# Altium schematic sheet Mosfet_Driver_Circuit.SchDoc
size A4; Organization: ArSilicii s.r.l.; Address1: Via Sardegna, 11; Address2: 53036 Poggibonsi (SI)  - ITALY -; Address3: e-mail : ArSilicii@ArSilicii.com; SheetNumber: 0; SheetTotal: 0
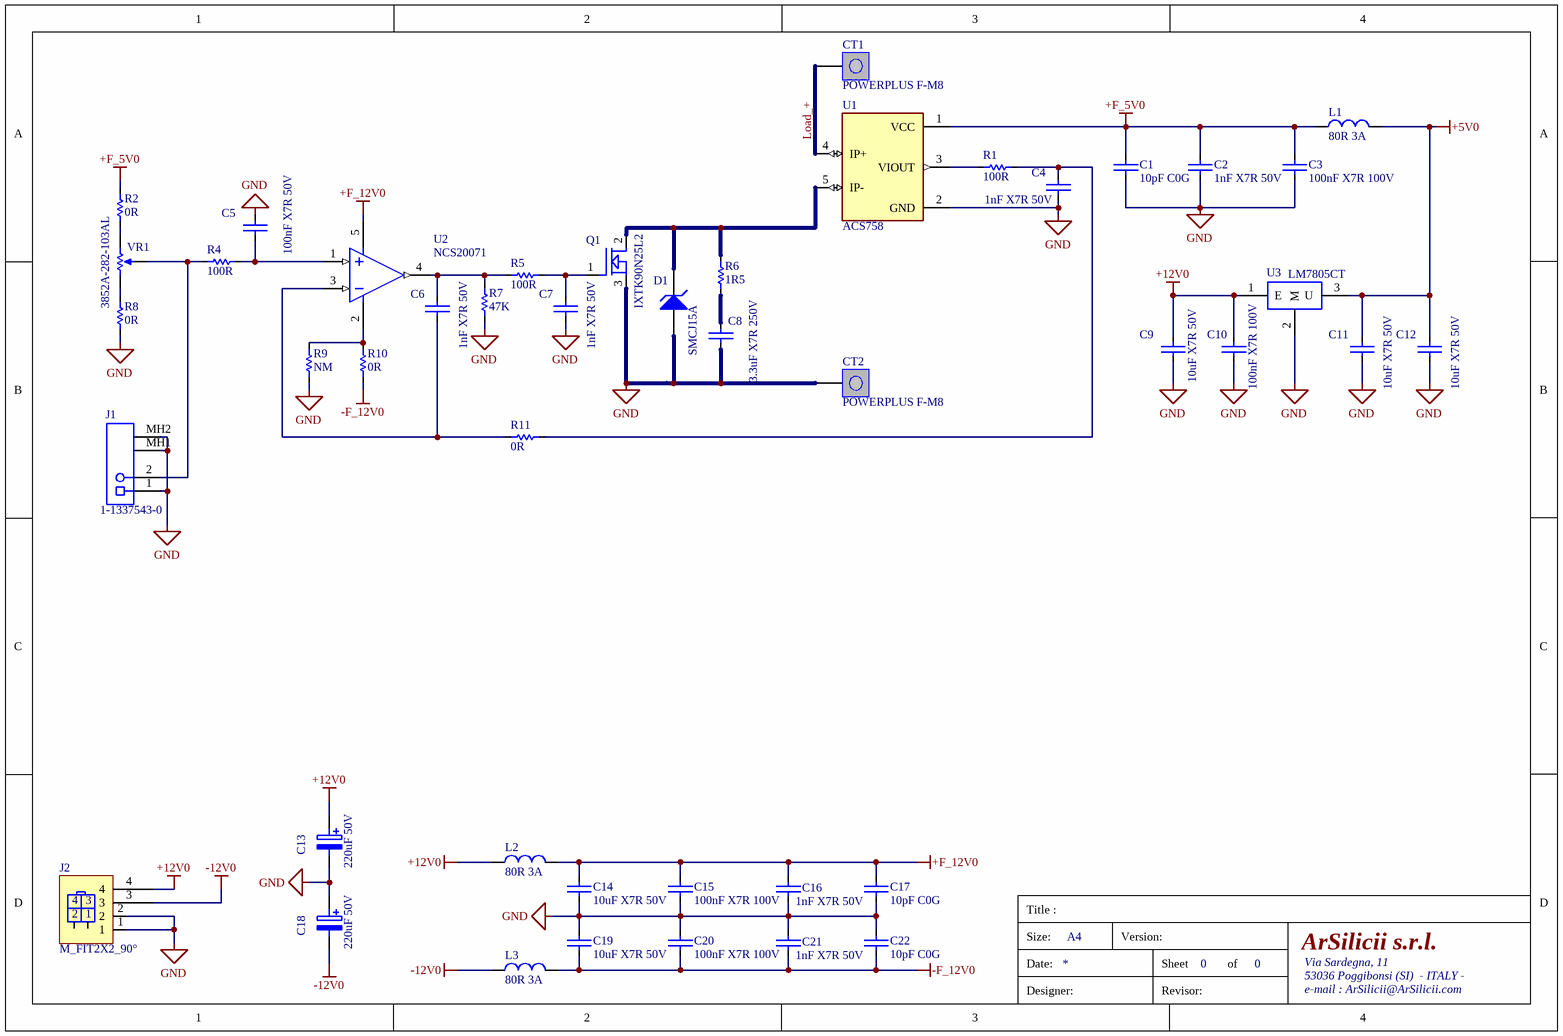
[diagram p0: Mosfet_Driver_Circuit.SchDoc]

## Parts
C1  10pF C0G  [0805]
C2  1nF X7R 50V  [0805]
C3  100nF X7R 100V  [0805]
C4  1nF X7R 50V  [0805]
C5  100nF X7R 50V  [0805]
C6  1nF X7R 50V  [0805]
C7  1nF X7R 50V  [0805]
C8  3.3uF X7R 250V  [2220]
C9  10uF X7R 50V  [1206]
C10  100nF X7R 100V  [0805]
C11  10uF X7R 50V  [1206]
C12  10uF X7R 50V  [1206]
C13  220uF 50V  [C_G55]
C14  10uF X7R 50V  [1206]
C15  100nF X7R 100V  [0805]
C16  1nF X7R 50V  [0805]
C17  10pF C0G  [0805]
C18  220uF 50V  [C_G55]
C19  10uF X7R 50V  [1206]
C20  100nF X7R 100V  [0805]
C21  1nF X7R 50V  [0805]
C22  10pF C0G  [0805]
CT1  POWERPLUS F-M8  [PowerPlus M8]
CT2  POWERPLUS F-M8  [PowerPlus M8]
D1  SMCJ15A  [LFUS-DO-214AB-2_V]
J1  1-1337543-0  [TECO-1-1337543-0_V]
J2  M_FIT2X2_90°  [M_FIT_JR2X2]
L1  80R 3A  [1206]
L2  80R 3A  [1206]
L3  80R 3A  [1206]
Q1  IXTK90N25L2  [TO-247]
R1  100R  [0805]
R2  0R  [0805]
R4  100R  [0805]
R5  100R  [0805]
R6  1R5  [2512]
R7  47K  [0805]
R8  0R  [0805]
R9  NM  [0805]
R10  0R  [0805]
R11  0R  [0805]
U1  ACS758  [XDCR_ACS758]
U2  NCS20071  [SOT-553-5]
U3  LM7805CT  [TO-220]
VR1  3852A-282-103AL  [BOUR-3852A-282-103AL-3_V]

## Nets
+5V0: C11.1 C12.1 L1.1 U3.3(U)
+12V0: C9.1 C10.1 C13.1 J2.4 L2.1 U3.1(E)
+F_5V0: C1.1 C2.1 C3.1 L1.2 R2.2 U1.1(VCC)
+F_12V0: C14.1 C15.1 C16.1 C17.1 L2.2 U2.5
-12V0: C18.2 J2.3 L3.1
-F_12V0: C19.2 C20.2 C21.2 C22.2 L3.2 R10.1
GND: C1.2 C2.2 C3.2 C4.2 C5.1 C7.2 C8.2 C9.2 C10.2 C11.2 C12.2 C13.2 C14.2 C15.2 C16.2 C17.2 C18.1 C19.1 C20.1 C21.1 C22.1 CT2.1 D1.1(A) J1.1 J1.MH1 J1.MH2 J2.1 J2.2 Q1.3(SOURCE) R7.2 R8.1 R9.1 U1.2(GND) U3.2(M)
Load_+: CT1.1 U1.4(IP+)
NetC4_1: C4.1 R1.2 R11.2
NetC5_2: C5.2 R4.2 U2.1
NetC6_1: C6.1 R5.1 R7.1 U2.4
NetC6_2: C6.2 R11.1 U2.3
NetC7_1: C7.1 Q1.1(GATE) R5.2
NetC8_1: C8.1 R6.2
NetD1_2: D1.2(K) Q1.2(DRAIN) R6.1 U1.5(IP-)
NetJ1_2: J1.2 R4.1 VR1.2(S)
NetR1_1: R1.1 U1.3(VIOUT)
NetR2_1: R2.1 VR1.3(CW)
NetR8_2: R8.2 VR1.1(CCW)
NetR9_2: R9.2 R10.2 U2.2

## Notes on the sheet
- Title :
- Size:
- Date:
- A4
- Version:
- Sheet
- of
- Designer:
- Revisor:

## Library data of the parts
C1 C17 C22 = CAP_10pF C0G_0805: Capacità; ArSilicii Part Number: CPC0614010; SMD/TH: SMD; 1 Supplier: *; 1 Supplier Part Number: *; 1 Supplier Unit Price: 0,09; 2 Supplier: *; 2 Supplier Part Number: *; 2 Supplier Unit Price: *; 3 Supplier: *; 3 Supplier Part Number: *; 3 Supplier Unit Price: *; Manufacturer: *; Manufacturer Part Number: *; ComponentLink1URL: *; ComponentLink2URL: *; ComponentLink1Description: *; ComponentLink2Description: *; HelpURL: *
C2 C4 C6 C7 C16 C21 = CAP_1nF X7R 50V_0805: Capacità; ArSilicii Part Number: CPC0213001; Manufacturer: EPCOS / TDK; Manufacturer Part Number: B37941K5102K60; SMD/TH: SMD; 1 Supplier: DISTAR S.R.L.; 1 Supplier Part Number: B37941K5102K60; 1 Supplier Unit Price: 0,00235; 2 Supplier: ARROW ELECTRONICS ITALIA S.R.L.; 2 Supplier Part Number: 0805B102K5CT; 2 Supplier Unit Price: *; 3 Supplier: *; 3 Supplier Part Number: *; 3 Supplier Unit Price: *; ComponentLink1URL: *; ComponentLink2URL: *; ComponentLink1Description: *; ComponentLink2Description: *; HelpURL: *
C3 C10 C15 C20 = CAP_100nF X7R 100V_0805: Capacità; ArSilicii Part Number: CPC0213101; Manufacturer: SAMSUNG; Manufacturer Part Number: CL21B104KCFSFNG; SMD/TH: SMD; 1 Supplier: ARROW ELECTRONICS ITALIA S.R.L.; 1 Supplier Part Number: CL21B104KCFSFNG; 1 Supplier Unit Price: *; 2 Supplier: FARNELL ITALIA S.R.L.; 2 Supplier Part Number: 1907331; 2 Supplier Unit Price: *; 3 Supplier: *; 3 Supplier Part Number: *; 3 Supplier Unit Price: *; ComponentLink1URL: *; ComponentLink2URL: *; ComponentLink1Description: *; ComponentLink2Description: *; HelpURL: *
C5 = CAP_100nF X7R 50V_0805: Capacità; ArSilicii Part Number: CPC0213100; Manufacturer: Kemet; Manufacturer Part Number: C0805C104K5RAC7800; SMD/TH: SMD; 1 Supplier: ARROW ELECTRONICS ITALIA S.R.L.; 1 Supplier Part Number: C0805C104K5RAC7800; 1 Supplier Unit Price: 0,00240; 2 Supplier: AVNET EMG ITALY S.R.L.; 2 Supplier Part Number: 08055C104KAT2A AVX; 2 Supplier Unit Price: *; 3 Supplier: *; 3 Supplier Part Number: *; 3 Supplier Unit Price: *; ComponentLink1URL: *; ComponentLink2URL: *; ComponentLink1Description: *; ComponentLink2Description: *; HelpURL: *
C8 = CAP_1uF X7R 250V_2220: Capacità; Manufacturer: TDK; Manufacturer Part Number: CGA9N3X7R2E105K230KA; SMD/TH: SMD; 1 Supplier: FARNELL ITALIA S.R.L.; 1 Supplier Part Number: 2435506; 1 Supplier Unit Price: 0,606; 2 Supplier: MOUSER; 2 Supplier Part Number: 810-CGA9N3X7R2E105K; 2 Supplier Unit Price: 0,594; 3 Supplier: *; 3 Supplier Part Number: *; 3 Supplier Unit Price: *; ArSilicii Part Number: *; ComponentLink1URL: *; ComponentLink2URL: *; ComponentLink1Description: *; ComponentLink2Description: *; HelpURL: *
C9 C11 C12 C14 C19 = CAP_10uF X7R 50V_1206: Capacità; ArSilicii Part Number: CPC0232011; Manufacturer Part Number: CL31B106KBHNNNE; SMD/TH: SMD; 1 Supplier: ARROW ELECTRONICS ITALIA S.R.L.; 1 Supplier Part Number: CL31B106KBHNNNE; 1 Supplier Unit Price: *; 2 Supplier: *; 2 Supplier Part Number: *; 2 Supplier Unit Price: *; 3 Supplier: *; 3 Supplier Part Number: *; 3 Supplier Unit Price: *; Manufacturer: *; ComponentLink1URL: *; ComponentLink2URL: *; ComponentLink1Description: Datasheet for 10uF X7R 25V; ComponentLink2Description: *; HelpURL: *
C13 C18 = CAP_EL_220uF 50V: Capacità polarizzata; ArSilicii Part Number: CPC0402221; Manufacturer: Nichicon; Manufacturer Part Number: UPS1H221MPD; SMD/TH: TH; 1 Supplier: ARROW ELECTRONICS ITALIA S.R.L.; 1 Supplier Part Number: *; 1 Supplier Unit Price: 0,04516; 2 Supplier: RS COMPONENTS S.P.A.; 2 Supplier Part Number: 5194346; 2 Supplier Unit Price: *; 3 Supplier: *; 3 Supplier Part Number: *; 3 Supplier Unit Price: *; ComponentLink1URL: http://docs-europe.electrocomponents.com/webdocs/0649/0900766b8064973a.pdf; ComponentLink2URL: *; ComponentLink1Description: Datasheet for 220uF 50V; ComponentLink2Description: *; HelpURL: *
CT1 CT2 = PAD_POWERPLUS F-M8: Singolo contatto; ArSilicii Part Number: QC04000180; Manufacturer: WURTH; Manufacturer Part Number: 93517; SMD/TH: TH; 1 Supplier: Würth Elektronik ICS GmbH & Co. KG; 1 Supplier Part Number: S98978; 1 Supplier Unit Price: *; 2 Supplier: *; 2 Supplier Part Number: *; 2 Supplier Unit Price: *; 3 Supplier: *; 3 Supplier Part Number: *; 3 Supplier Unit Price: *; ComponentLink1URL: *; ComponentLink2URL: *; ComponentLink1Description: *; ComponentLink2Description: *; HelpURL: *
D1 = CMP-2000-07102-1: Transient Voltage Suppression Diode, 15 V, -65 to 150 degC, 2-Pin DO-214AB (SMCJ), RoHS, Tape and Reel; Manufacturer: Littelfuse; Directional: Uni-Directional; Power Dissipation: 1500W; Clamping Voltage-Max: 24.4V; Breakdown Voltage-Min: 16.7V; Breakdown Voltage-Max: 18.5V; Mounting Technology: SurfaceMount; Package Reference: DO-214AB; Manufacturer URL: http://www.littelfuse.com/; Package Description: 2-Pin Surface Mount Device, Body 6.855 x 5.905 mm; Datasheet URL: http://www.littelfuse.com/products/tvs-diodes/surface-mount/~/media/electronics/datasheets/tvs_diodes/littelfuse_tvs_diode_smcj_datasheet.pdf.pdf; Datasheet Version: 11/2015
J1 = CMP-2000-05853-1: Female Connector, Pitch 2.54 mm, 1 x 2 Position, Height 15.8 mm, Tail Length 3.8 mm, / -55 to 85 degC, RoHS, Bulk; Manufacturer: TE Connectivity; Connector Body Style: RightAngleJack; Frequency Max: 4GHz; Coaxial Termination: Solder; Connector Mounting: PCBMount; SVHC: ToBeAdvised; Connector Type: BNCCoaxial; Impedance: 50ohm; Coaxial Cable Types: -; Manufacturer URL: http://www.te.com/; Package Reference: 1-1337543-0; Product Range: -; Datasheet URL: http://www.te.com/commerce/DocumentDelivery/DDEController?Action=showdoc&DocId=Customer+Drawing%7F1337543%7FG%7Fpdf%7FEnglish%7FENG_CD_1337543_G.pdf%7F1-1337543-0; Contact Plating: GoldPlatedContacts; Mounting Technology: ThroughHole; Package Description: Female Connector, Pitch 2.54 mm, 1 x 2 Position, Height 15.8 mm, Tail Length 3.8 mm; Contact Material: Brass; Datasheet Version: Rev. G, 12/2012
J2 = M_FIT2X2_90°: Mini Fit Junior 4 poli; ArSilicii Part Number: QA02001000; Manufacturer: Molex; Manufacturer Part Number: 87427-0403; SMD/TH: TH; 1 Supplier: ABACUS ECC S.R.L. - UNIPERSONALE; 1 Supplier Part Number: *; 1 Supplier Unit Price: 0,10556; 2 Supplier: ELECTRO-LINE S.R.L.; 2 Supplier Part Number: *; 2 Supplier Unit Price: *; 3 Supplier: SIRIO S.R.L.; 3 Supplier Part Number: C4255WR-2X2P; 3 Supplier Unit Price: *; ComponentLink1URL: http://datasheet.octopart.com/87427-0403-Molex-datasheet-13790610.pdf; ComponentLink2URL: *; ComponentLink1Description: Datasheet for M_FIT2X2_90°; ComponentLink2Description: *; HelpURL: *
L1-L3 = Ferrite 80R 3A: Ferrite; ArSilicii Part Number: CPF0006000; Manufacturer: Wurth Elektronik; Manufacturer Part Number: 74279215; SMD/TH: SMD; 1 Supplier: RS COMPONENTS S.P.A.; 1 Supplier Part Number: 3275550P; 1 Supplier Unit Price: 0,21000; 2 Supplier: *; 2 Supplier Part Number: *; 2 Supplier Unit Price: *; 3 Supplier: *; 3 Supplier Part Number: *; 3 Supplier Unit Price: *; ComponentLink1URL: http://docs-europe.electrocomponents.com/webdocs/0033/0900766b80033a26.pdf; ComponentLink2URL: *; ComponentLink1Description: Datasheet for Ferrite 80R 3A; ComponentLink2Description: *; HelpURL: *; Supplier 1: Digi-Key; Supplier Part Number 1: 732-1629-1-ND
Q1 = IXTK90N25L2: MOS CANALE N-250V-90A Linear; ArSilicii Part Number: CPTP200080; Manufacturer Part Number: IPB90N06S404ATMA2; SMD/TH: SMD; 1 Supplier: EBV ELEKTRONIK S.R.L.; 1 Supplier Part Number: PB90N06S4-04; 1 Supplier Unit Price: 0,56; 2 Supplier: RS COMPONENTS S.R.L.; 2 Supplier Part Number: 826-9042P; 2 Supplier Unit Price: *; 3 Supplier: *; 3 Supplier Part Number: *; 3 Supplier Unit Price: *; Manufacturer: *; ComponentLink1URL: *; ComponentLink2URL: *; ComponentLink1Description: *; ComponentLink2Description: *; HelpURL: *
R1 R2 R4-R11 = RES_SMD: Resistenza; SMD/TH: SMD; 1 Supplier: *; 1 Supplier Part Number: *; 1 Supplier Unit Price: *; 2 Supplier: *; 2 Supplier Part Number: *; 2 Supplier Unit Price: *; 3 Supplier: *; 3 Supplier Part Number: *; 3 Supplier Unit Price: *; ArSilicii Part Number: *; Manufacturer: *; Manufacturer Part Number: *; ComponentLink1URL: *; ComponentLink2URL: *; ComponentLink1Description: *; ComponentLink2Description: *; HelpURL: *
U1 = ACS758: Current Sensor 50A 1 Channel Hall Effect, Open Loop Unidirectional 5-CB Formed Leads, PFF; MF: Allegro MicroSystems LLC; Package: 5-CB-5 Allegro MicroSystems LLC; MP: ACS758; Availability: *; Price: *; Value: *
U2 = NCS20071: Rail-to-Rail Input/Output, 3 MHz Op Amps; Manufacturer: Microchip Technology; Manufacturer Part Number: MCP6021-E/SN; SMD/TH: SMD; 1 Supplier: DigiKey; 1 Supplier Part Number: MCP6021-E/SN-ND; 1 Supplier Unit Price: 1,22; 2 Supplier: *; 2 Supplier Part Number: *; 2 Supplier Unit Price: *; 3 Supplier: *; 3 Supplier Part Number: *; 3 Supplier Unit Price: *; ArSilicii Part Number: *; ComponentLink1URL: http://ww1.microchip.com/downloads/en/DeviceDoc/21685d.pdf; ComponentLink2URL: *; ComponentLink1Description: Datasheet for MCP6021; ComponentLink2Description: *; HelpURL: *
U3 = LM7805CT: Stabilizzatore 5Volt 7805; ArSilicii Part Number: IC01007010; Manufacturer: Fairchild Semiconductor; SMD/TH: TH; 1 Supplier: ARROW ELECTRONICS ITALIA S.R.L.; 1 Supplier Part Number: *; 1 Supplier Unit Price: 0,085; 2 Supplier: *; 2 Supplier Part Number: *; 2 Supplier Unit Price: *; 3 Supplier: *; 3 Supplier Part Number: *; 3 Supplier Unit Price: *; Manufacturer Part Number: LM7805CT; ComponentLink1URL: http://www.fairchildsemi.com/ds/LM/LM7805.pdf; ComponentLink2URL: *; ComponentLink1Description: Datasheet for LM7805CT; ComponentLink2Description: *; HelpURL: *
VR1 = CMP-2000-05079-1: Diameter Panel Control, 10 KOhm, +/- 10%, 2 W, -1 to 125 degC, 3-Pin THD, RoHS, Bulk; Manufacturer: Bourns; Temperature Coefficient: ±150ppm/degC; Number of Gangs: 1; Other Names: 3852A282103AL; Actuator Length: 0.875"(22.23mm); Resistive Material: Cermet; PCN Design/Specification: PBTResinJun/2011; Rotation: 280deg; PCN Other: MultipleChanges01/Dec/2012; Catalog Drawings: 3852SeriesSide1 / 3852SeriesSide2; Online Catalog: 3852and3856Series; Associated Product: 36-8560-ND / -KNOBINSTRUMW/DIALRND.9"DIA / 36-8555-ND / -KNOBINSTRUMSKIRTEDRND.7"DIA / 36-8556-ND / -KNOBINSTRUMSKIRTEDRND.9"DIA / 36-8565-ND / -KNOBINSTRUMDBLBARRND.7"DIA / 36-8566-ND / -KNOBINSTRUMDBLBARRND.9"DIA / 36-8568-ND / -KNOBINSTRUMSGLBARRND.7"DIA / 36-8569-ND / -KNOBINSTRUMSGLBARRND.9"DIA / 36-8559-ND / -KNOBINSTRUMW/DIALRND.7"DIA / 226-1006-ND / -KNOBBLKGLOSS.75"DIA.250"SHAFT / 226-1007-ND / -KNOBBLKGLOSS.925"DIA.250"SHAFT / 226-1011-ND / -KNOBBLKGLOS; Actuator Diameter: 0.250"(6.35mm); Built in Switch: None; Resistance (Ohms): 10k; Power (Watts): 2W; Actuator Type: Slotted; Standard Package: 45; Tolerance: ±10%; Taper: Linear; Series: 3852; Packaging: Bulk; Category: Potentiometers,VariableResistors; Bushing Thread: 3/8-32; Datasheet URL: https://datasheet.ciiva.com/11831/0900766b80f93b4b-11831016.pdf; Datasheet Version: Sep-14; Number of Turns: 1; Family: RotaryPotentiometers,Rheostats; Termination Style: SolderLug; RoHS Information: 3852A-LMaterialDeclaration; Mounting Type: PanelMount; Manufacturer URL: http://www.bourns.com/